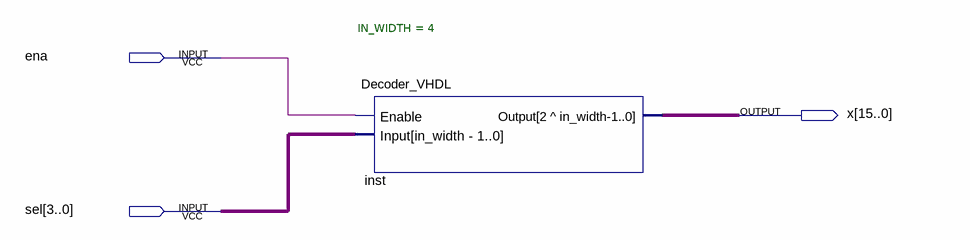
[diagram p0: schematic sheet]
// Quartus schematic DECODER.bdf as structural Verilog: 1 symbols, 3 pins
module DECODER (
  input  ena,
  input  [3:0] sel,
  output [15:0] x
);

  Decoder_VHDL #(.IN_WIDTH(4)) inst (.Enable(ena), .Input(sel), .Output(x));
endmodule
